# EAGLE design split-supply-2.5 (EAGLE 9.5.0)
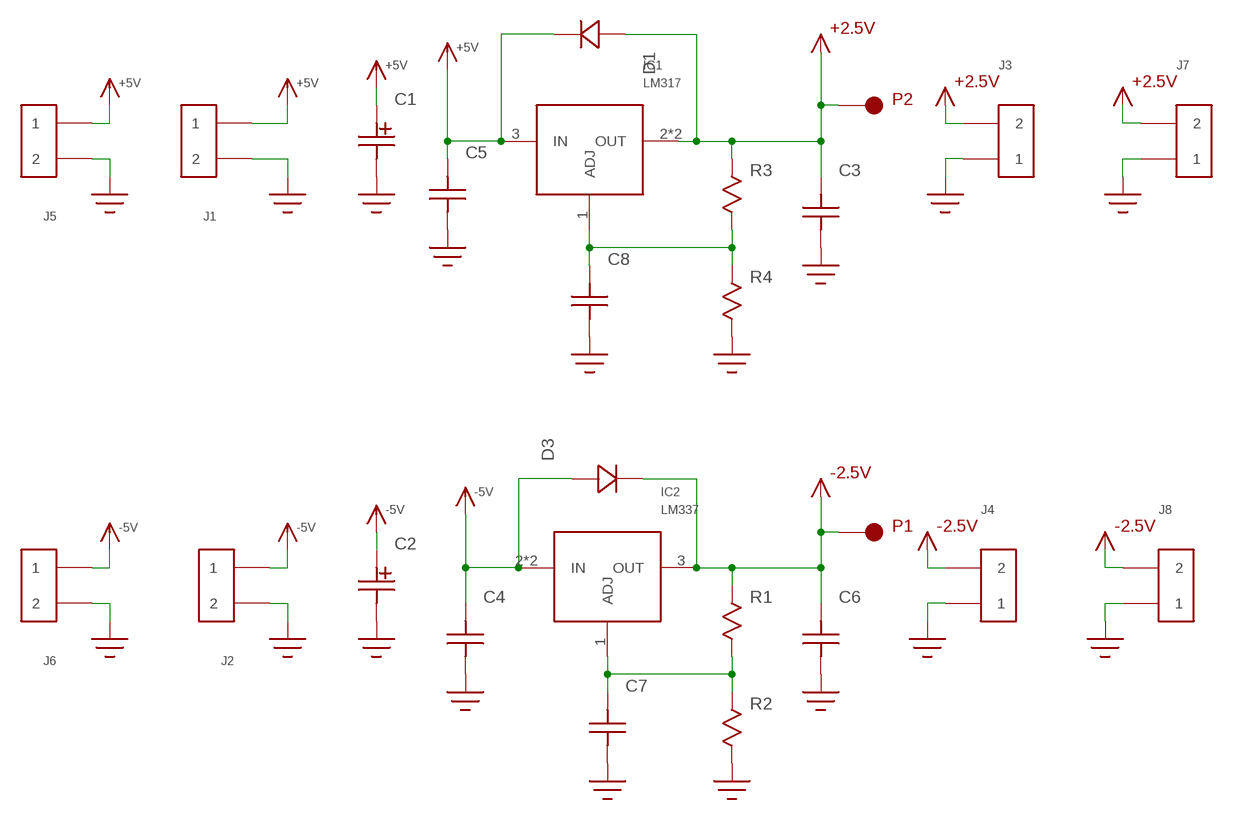
[diagram p0: schematic, sheet 1]

## Parts
C1  C-POLARIZED  [CAP-E61]
C2  C-POLARIZED  [CAP-E61]
C3  C1206  [1206]
C4  C1206  [1206]
C5  C1206  [1206]
C6  C1206  [1206]
C7  C0603  [C0603]
C8  C0603  [C0603]
D1  DIODE  [DO-214(SMA)]
D3  DIODE  [DO-214(SMA)]
IC1  LM317  LM317SOT-223  [SOT-223]
IC2  LM337  [SOT-223]
J1  HEADER_2PIN  [HEADER_2PIN]
J2  HEADER_2PIN  [HEADER_2PIN]
J3  HEADER_2PIN  [HEADER_2PIN]
J4  HEADER_2PIN  [HEADER_2PIN]
J5  HEADER_2PINSCREW-TERM  [FCI_20020316_SCREW_TERM_2P]
J6  HEADER_2PINSCREW-TERM  [FCI_20020316_SCREW_TERM_2P]
J7  HEADER_2PINSCREW-TERM  [FCI_20020316_SCREW_TERM_2P]
J8  HEADER_2PINSCREW-TERM  [FCI_20020316_SCREW_TERM_2P]
P1  ICSP_PAD  [ICSP_PAD]
P2  ICSP_PAD  [ICSP_PAD]
R1  R0603  [R0603]
R2  R0603  [R0603]
R3  R0603  [R0603]
R4  R0603  [R0603]

## Nets
+2.5V: C3.P$2 D1.C(CATHODE) IC1.2(OUT) IC1.4(OUT) J3.2 J7.P$2 P2.P$1 R3.P$1
+5V: C1.+ C5.P$2 D1.A(ANODE) IC1.3(IN) J1.1 J5.P$1
-2.5V: C6.P$2 D3.A(ANODE) IC2.3(OUT) J4.2 J8.P$2 P1.P$1 R1.P$1
-5V: C2.+ C4.P$2 D3.C(CATHODE) IC2.2(IN) IC2.4(IN) J2.1 J6.P$1
GND: C1.- C2.- C3.P$1 C4.P$1 C5.P$1 C6.P$1 C7.P$1 C8.P$1 J1.2 J2.2 J3.1 J4.1 J5.P$2 J6.P$2 J7.P$1 J8.P$1 R2.P$2 R4.P$2
N$2: C7.P$2 IC2.1(ADJ) R1.P$2 R2.P$1
N$3: C8.P$2 IC1.1(ADJ) R3.P$2 R4.P$1

## Library data of the parts
C1 C2 = yapo:C-POLARIZED
C3-C8 = yapo:C
D1 D3 = yapo:DIODE
IC1 = yapo:LM317
IC2 = yapo:LM337
J1-J8 = yapo:HEADER_2PIN
P1 P2 = yapo:ICSP_PAD
R1-R4 = yapo:R

## Board
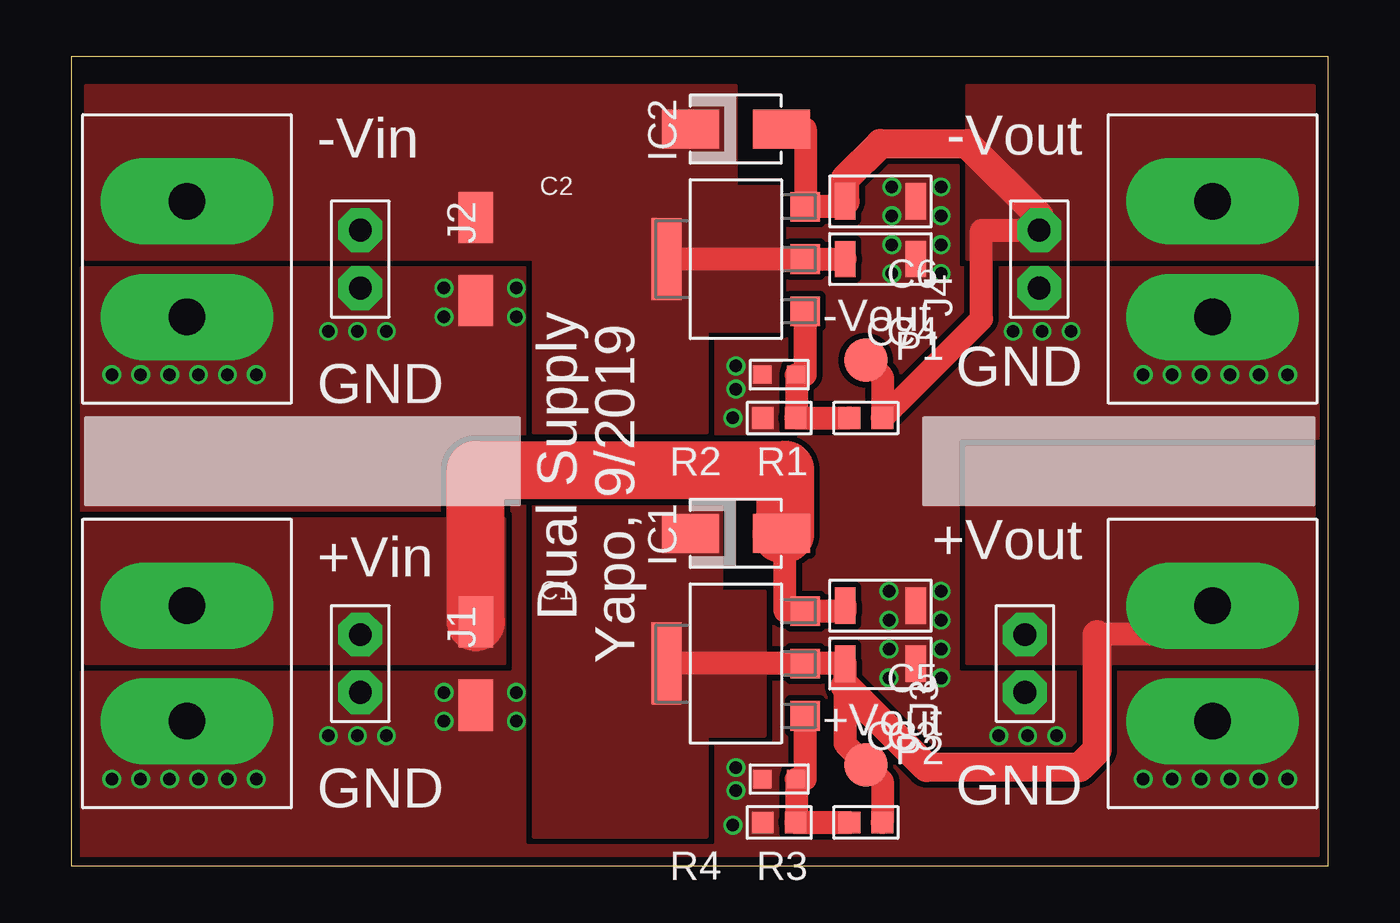
[diagram p1: board, top side]
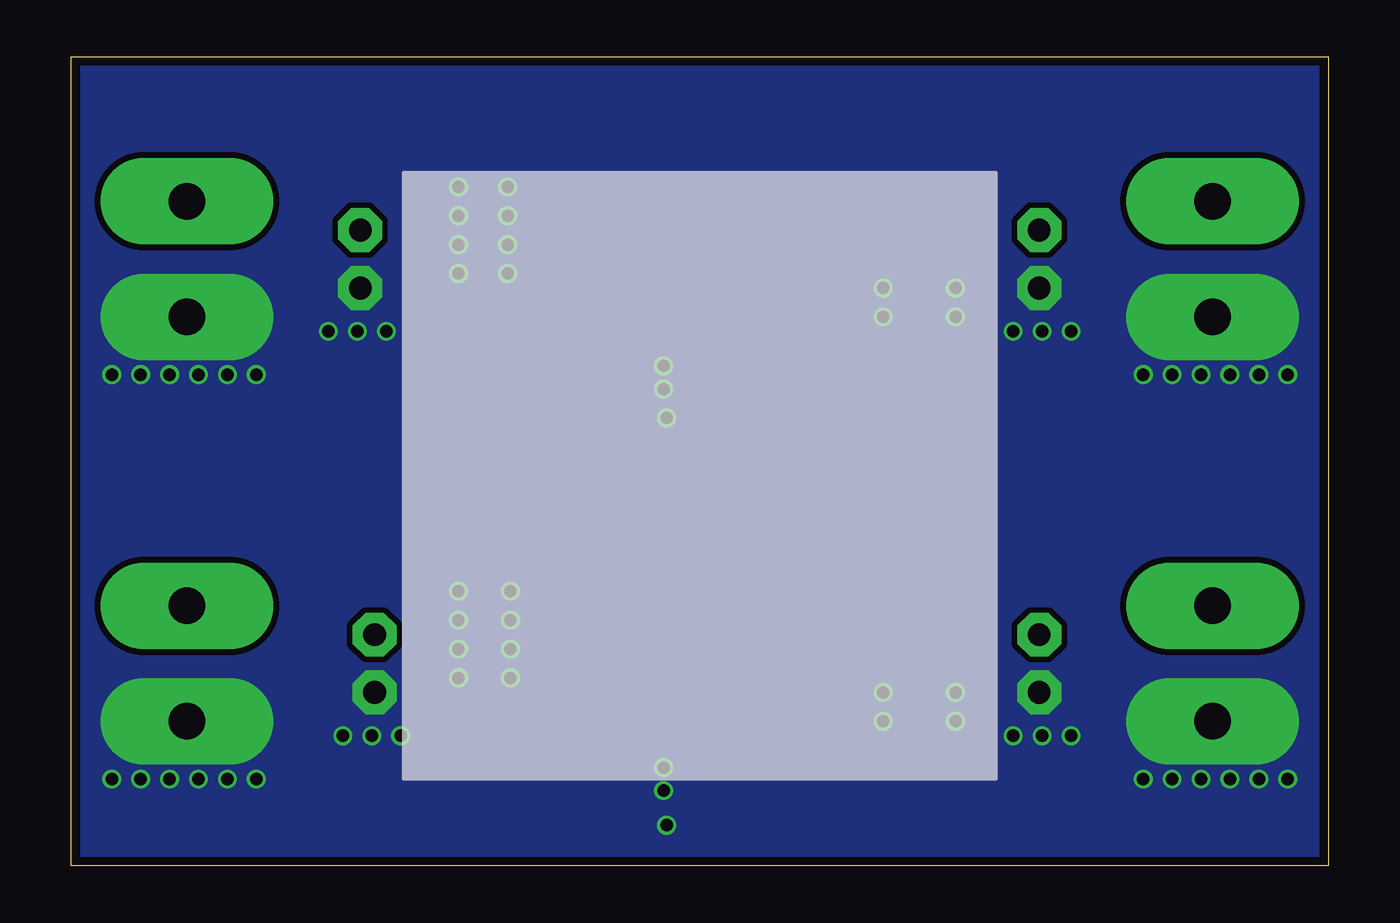
[diagram p2: board, bottom side, seen from below]

Size 55.24 x 35.56 mm. Coordinates in mm from the lower left corner, seen from the top.
Outline: 0,0 55.24,0 55.24,35.56 0,35.56 0,0
Copper layers (1*16): Top 0.035559375mm / dielectric 1.6mm / Bottom 0.035559375mm
Design rules "oshpark-2layer *": minimum track width 6mil, minimum drill 10mil, track to track 6mil, track to pad 6mil, pad to pad 6mil, via to via 6mil, smd to smd 6mil, copper to edge 15mil, drill to drill 6mil, minimum pad ring 5mil, minimum via ring 5mil, stop-mask expansion 2.5mil, vias tented up to drill 25mil, thermal gap 10mil

### Footprints (pad centres in the part's own frame; a part is rotated, then mirrored left to right if it is on the bottom)
CAP-E61 = smd 1.5 x 2.25: + 0,1.825; - 0,-1.825
1206 = smd 0.9 x 1.6: P$1 -1.55,0; P$2 1.55,0
C0603 = smd 0.8 x 0.8: P$1 -0.75,0; P$2 0.75,0
DO-214(SMA) = smd 2.5 x 1.7: A -2,0; C 2,0
SOT-223 = smd 1.3 x 1.3: 1 -2.3,-3.05; 2 0,-3.05; 3 2.3,-3.05 | smd 3.6 x 1.3: 4 0,3.05
HEADER_2PIN = drill 1 pad 1.93 octagon: 1 -1.27,0; 2 1.27,0
FCI_20020316_SCREW_TERM_2P = drill 1.6 pad 3.81 long: P$1 -2.54,0; P$2 2.54,0
ICSP_PAD = smd 1.905 x 1.905: P$1 0,0
R0603 = smd 0.95 x 0.95: P$1 -0.725,0; P$2 0.725,0

### Placement (x,y rotation side)
C1  17.78,8.89 0 top
C2  17.78,26.67 0 top
C3  35.56,8.89 180 top
C4  35.56,26.67 180 top
C5  35.56,11.43 180 top
C6  35.56,29.21 180 top
C7  31.11,21.59 0 top
C8  31.11,3.81 0 top
D1  29.21,14.61 180 top
D3  29.21,32.38 180 top
IC1  29.21,8.89 90 top
IC2  29.21,26.67 90 top
J1  12.7,8.89 270 top
J2  12.7,26.67 270 top
J3  41.91,8.89 90 top
J4  42.55,26.67 90 top
J5  5.08,8.89 270 top
J6  5.08,26.67 270 top
J7  50.16,8.89 90 top
J8  50.16,26.67 90 top
P1  34.92,22.23 0 top
P2  34.92,4.45 0 top
R1  34.92,19.68 180 top
R2  31.11,19.68 180 top
R3  34.92,1.91 180 top
R4  31.11,1.91 180 top

### Tracks (layer width: path | path; a pad name or v marks a point on that pad's centre or on a via)
+2.5V
  Top 1.016: C3.P$2 IC1.2 IC1.4 | R3.P$1 35.65,3.72 P2.P$1 34.01,5.36 C3.P$2 | J7.P$2 48.9,10.16 45.09,10.16 | 34.01,7.9 C3.P$2
  Top 1.27: 45.09,10.16 45.09,5.08 44.32,4.32 37.59,4.32 34.01,7.9
  pour Top (isolate 0.254, no thermals): 27.94,1.27 27.94,5.71 30.48,5.71 30.48,12.06 28.57,12.06 28.57,15.88 20.32,15.88 20.32,1.27
  pour Top (no thermals): 39.37,8.89 54.61,8.89 54.61,18.41 39.37,18.41
+5V
  Top 1.016: C5.P$2 34.01,11.19 IC1.3 31.37,11.19 31.37,14.61
  Top 2.54: C1.+ 17.78,17.4 31.37,17.4 31.37,14.61 D1.A
  pour Top (no thermals): 0.64,8.89 19.05,8.89 19.05,15.24 0.64,15.24
-2.5V
  Top 1.016: C6.P$2 34.01,28.97 IC2.3 32.26,32.38 D3.A | J4.2 40.01,27.94 40.01,24.04 R1.P$1 35.65,21.5 P1.P$1
  Top 1.27: C6.P$2 34.01,30.2 35.56,31.75 39.37,31.75 42.55,28.57 J4.2
  pour Top (no thermals): 54.61,26.67 54.61,34.29 39.37,34.29 39.37,26.67
-5V
  Top 1.016: C4.P$2 IC2.2 IC2.4
  pour Top (no thermals): 0.64,34.29 29.21,34.29 29.21,29.84 31.11,29.84 31.11,23.5 27.94,23.5 27.94,19.05 20.32,19.05 20.32,26.67 0.64,26.67
GND  (via drill 0.55)
  other vias: 16.38,25.4 16.38,24.13 19.56,25.4 19.56,24.13 16.38,7.62 16.38,6.35 19.56,7.62 19.56,6.35 11.3,5.71 12.57,5.71 13.84,5.71 11.3,23.5 12.57,23.5 13.84,23.5 1.78,21.59 3.05,21.59 4.32,21.59 5.59,21.59 6.86,21.59 8.13,21.59 1.78,3.81 3.05,3.81 4.32,3.81 5.59,3.81 6.86,3.81 8.13,3.81 36.07,29.84 38.23,27.3 38.23,29.84 38.23,28.57 38.23,26.04 36.07,28.57 36.07,27.3 36.07,26.04 42.67,23.5 41.4,23.5 43.94,23.5 47.12,21.59 48.39,21.59 49.66,21.59 50.93,21.59 52.2,21.59 53.47,21.59 38.23,12.06 38.23,10.79 35.94,12.06 35.94,10.79 35.94,9.53 35.94,8.26 38.23,8.26 38.23,9.53 42.04,5.71 40.77,5.71 43.31,5.71 47.12,3.81 48.39,3.81 49.66,3.81 50.93,3.81 52.2,3.81 53.47,3.81 29.21,4.32 29.21,3.3 29.08,1.78 29.21,21.97 29.21,20.95 29.08,19.68
  pour Top (isolate 0.254, rank 2, no thermals): 0,0 55.24,0 55.24,35.56 0,35.56
  pour Bottom (isolate 0.254, no thermals): 0,0 55.24,0 55.24,35.56 0,35.56
N$2
  Top 1.016: IC2.1 32.26,21.59 C7.P$2 31.86,19.68 R2.P$1 R1.P$2
N$3
  Top 1.016: IC1.1 32.26,3.81 C8.P$2 31.86,1.91 R4.P$1 R3.P$2

### Text on the board
tPlace: -Vout | -Vin | -Vout | GND | GND | +Vout | +Vin | Dual Supply | Yapo, 9/2019 | +Vout | GND | GND